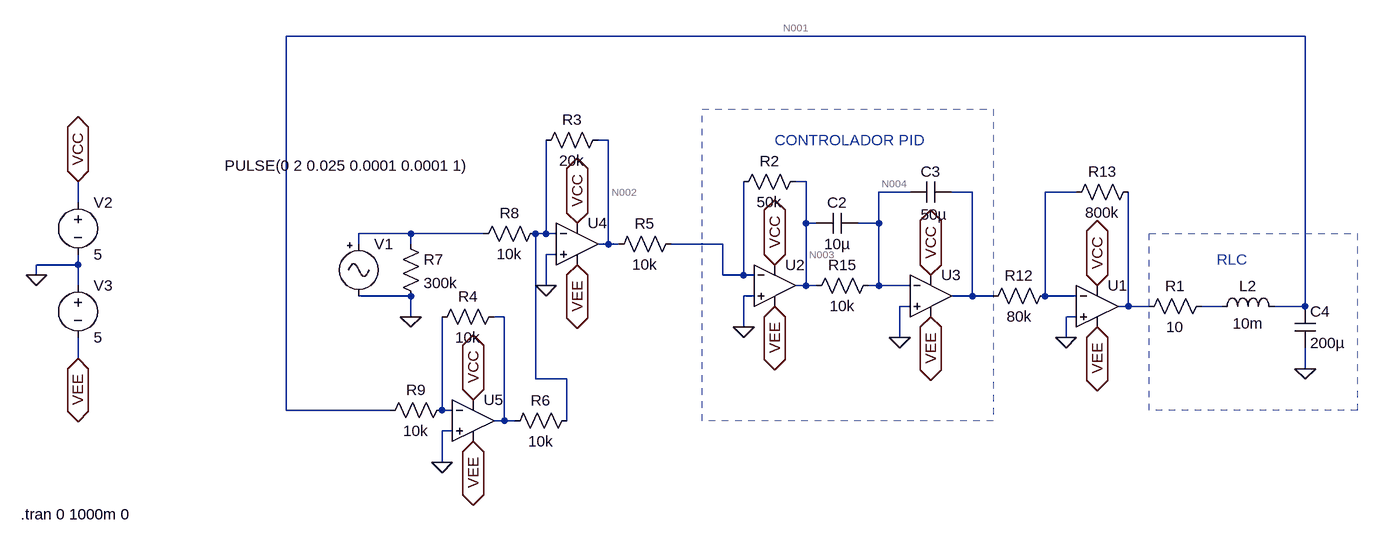
[diagram p0: schematic Pid.asc]
Pid.asc, the LTspice schematic file:
Version 4.1
SHEET 1 3800 680
WIRE 3584 -1296 2016 -1296
WIRE 2512 -1136 2496 -1136
WIRE 2816 -1072 2800 -1072
WIRE 2976 -1056 2928 -1056
WIRE 3072 -1056 3040 -1056
WIRE 3232 -1056 3184 -1056
WIRE 1696 -1040 1696 -1072
WIRE 2816 -1008 2816 -1072
WIRE 2832 -1008 2816 -1008
WIRE 2928 -1008 2928 -1056
WIRE 2928 -1008 2896 -1008
WIRE 2208 -992 2128 -992
WIRE 2320 -992 2208 -992
WIRE 2416 -992 2416 -1136
WIRE 2416 -992 2400 -992
WIRE 2432 -992 2416 -992
WIRE 2128 -976 2128 -992
WIRE 2208 -976 2208 -992
WIRE 2512 -976 2512 -1136
WIRE 2512 -976 2496 -976
WIRE 2528 -976 2512 -976
WIRE 2688 -976 2608 -976
WIRE 2432 -960 2416 -960
WIRE 1696 -944 1696 -960
WIRE 1696 -944 1632 -944
WIRE 1632 -928 1632 -944
WIRE 2688 -928 2688 -976
WIRE 2720 -928 2720 -1072
WIRE 2720 -928 2688 -928
WIRE 2736 -928 2720 -928
WIRE 1696 -912 1696 -944
WIRE 2416 -912 2416 -960
WIRE 2816 -912 2816 -1008
WIRE 2816 -912 2800 -912
WIRE 2832 -912 2816 -912
WIRE 2928 -912 2928 -1008
WIRE 2928 -912 2912 -912
WIRE 2976 -912 2928 -912
WIRE 2208 -896 2128 -896
WIRE 2736 -896 2720 -896
WIRE 3072 -896 3072 -1056
WIRE 3072 -896 3040 -896
WIRE 3104 -896 3072 -896
WIRE 3184 -896 3184 -1056
WIRE 3232 -896 3184 -896
WIRE 2976 -880 2960 -880
WIRE 3312 -880 3312 -1056
WIRE 3312 -880 3296 -880
WIRE 3344 -880 3312 -880
WIRE 3456 -880 3424 -880
WIRE 3584 -880 3584 -1296
WIRE 3584 -880 3536 -880
WIRE 2208 -864 2208 -896
WIRE 2352 -864 2336 -864
WIRE 3232 -864 3216 -864
WIRE 2720 -848 2720 -896
WIRE 2960 -832 2960 -880
WIRE 3216 -832 3216 -864
WIRE 1696 -800 1696 -832
WIRE 3584 -784 3584 -816
WIRE 2400 -768 2400 -992
WIRE 2448 -768 2400 -768
WIRE 2016 -720 2016 -1296
WIRE 2176 -720 2016 -720
WIRE 2256 -720 2256 -864
WIRE 2272 -720 2256 -720
WIRE 2352 -704 2352 -864
WIRE 2352 -704 2336 -704
WIRE 2368 -704 2352 -704
WIRE 2448 -704 2448 -768
WIRE 2272 -688 2256 -688
WIRE 2256 -640 2256 -688
FLAG 1696 -1072 VCC
IOPIN 1696 -1072 BiDir
FLAG 1696 -800 VEE
IOPIN 1696 -800 BiDir
FLAG 3584 -784 0
FLAG 2960 -832 0
FLAG 2768 -944 VCC
IOPIN 2768 -944 BiDir
FLAG 3008 -928 VCC
IOPIN 3008 -928 BiDir
FLAG 2768 -880 VEE
IOPIN 2768 -880 BiDir
FLAG 3008 -864 VEE
IOPIN 3008 -864 BiDir
FLAG 3216 -832 0
FLAG 3264 -912 VCC
IOPIN 3264 -912 BiDir
FLAG 3264 -848 VEE
IOPIN 3264 -848 BiDir
FLAG 1632 -928 0
FLAG 2720 -848 0
FLAG 2464 -1008 VCC
IOPIN 2464 -1008 BiDir
FLAG 2464 -944 VEE
IOPIN 2464 -944 BiDir
FLAG 2416 -912 0
FLAG 2304 -736 VCC
IOPIN 2304 -736 BiDir
FLAG 2304 -672 VEE
IOPIN 2304 -672 BiDir
FLAG 2256 -640 0
FLAG 2208 -864 0
SYMBOL voltage 1696 -1056 R0
WINDOW 123 0 0 Left 0
WINDOW 39 0 0 Left 0
SYMATTR InstName V2
SYMATTR Value 5
SYMBOL voltage 1696 -928 R0
WINDOW 123 0 0 Left 0
WINDOW 39 0 0 Left 0
SYMATTR InstName V3
SYMATTR Value 5
SYMBOL res 2816 -896 R270
WINDOW 0 32 56 VTop 2
WINDOW 3 0 56 VBottom 2
SYMATTR InstName R15
SYMATTR Value 10k
SYMBOL cap 2896 -1024 R90
WINDOW 0 0 32 VBottom 2
WINDOW 3 32 32 VTop 2
SYMATTR InstName C2
SYMATTR Value 10µ
SYMBOL cap 3040 -1072 R90
WINDOW 0 0 32 VBottom 2
WINDOW 3 35 27 VTop 2
SYMATTR InstName C3
SYMATTR Value 50µ
SYMBOL ind 3440 -864 R270
WINDOW 0 32 56 VTop 2
WINDOW 3 5 56 VBottom 2
SYMATTR InstName L2
SYMATTR Value 10m
SYMBOL cap 3568 -880 R0
SYMATTR InstName C4
SYMATTR Value 200µ
SYMBOL res 3200 -912 R90
WINDOW 0 0 56 VBottom 2
WINDOW 3 32 56 VTop 2
SYMATTR InstName R12
SYMATTR Value 80k
SYMBOL res 3328 -1072 R90
WINDOW 0 0 56 VBottom 2
WINDOW 3 32 56 VTop 2
SYMATTR InstName R13
SYMATTR Value 800k
SYMBOL OpAmps\\UniversalOpAmp2 3264 -880 R0
SYMATTR InstName U1
SYMBOL res 3440 -896 R90
WINDOW 0 0 56 VBottom 2
WINDOW 3 32 56 VTop 2
SYMATTR InstName R1
SYMATTR Value 10
SYMBOL OpAmps\\UniversalOpAmp2 3008 -896 R0
SYMATTR InstName U3
SYMBOL OpAmps\\UniversalOpAmp2 2768 -912 R0
SYMATTR InstName U2
SYMBOL res 2816 -1088 R90
WINDOW 0 0 56 VBottom 2
WINDOW 3 32 56 VTop 2
SYMATTR InstName R2
SYMATTR Value 50k
SYMBOL OpAmps\\UniversalOpAmp2 2464 -976 R0
SYMATTR InstName U4
SYMBOL res 2512 -1152 R90
WINDOW 0 0 56 VBottom 2
WINDOW 3 32 56 VTop 2
SYMATTR InstName R3
SYMATTR Value 20k
SYMBOL OpAmps\\UniversalOpAmp2 2304 -704 R0
SYMATTR InstName U5
SYMBOL res 2352 -880 R90
WINDOW 0 0 56 VBottom 2
WINDOW 3 32 56 VTop 2
SYMATTR InstName R4
SYMATTR Value 10k
SYMBOL res 2624 -992 R90
WINDOW 0 0 56 VBottom 2
WINDOW 3 32 56 VTop 2
SYMATTR InstName R5
SYMATTR Value 10k
SYMBOL res 2464 -720 R90
WINDOW 0 0 56 VBottom 2
WINDOW 3 32 56 VTop 2
SYMATTR InstName R6
SYMATTR Value 10k
SYMBOL res 2192 -992 R0
SYMATTR InstName R7
SYMATTR Value 300k
SYMBOL res 2416 -1008 R90
WINDOW 0 0 56 VBottom 2
WINDOW 3 32 56 VTop 2
SYMATTR InstName R8
SYMATTR Value 10k
SYMBOL Misc\\signal 2128 -992 R0
WINDOW 3 -206 -105 Left 2
WINDOW 123 0 0 Left 0
WINDOW 39 0 0 Left 0
SYMATTR Value PULSE(0 2 0.025 0.0001 0.0001 1)
SYMATTR InstName V1
SYMBOL res 2272 -736 R90
WINDOW 0 0 56 VBottom 2
WINDOW 3 32 56 VTop 2
SYMATTR InstName R9
SYMATTR Value 10k
TEXT 2768 -1136 Left 2 ;CONTROLADOR PID
TEXT 3448 -952 Left 2 ;RLC
TEXT 1608 -560 Left 2 !.tran 0 1000m 0
RECTANGLE Normal 3104 -704 2656 -1184 2
RECTANGLE Normal 3664 -720 3344 -992 2

The netlist it stands for:
* Pid.asc
V2 VCC 0 5
V3 0 VEE 5
R15 N003 N004 10k
C2 N004 N003 10µ
C3 N005 N004 50µ
L2 N011 N001 10m
C4 N001 0 200µ
R12 N006 N005 80k
R13 N010 N006 800k
X§U1 0 N006 VCC VEE N010 level2 Avol=1Meg GBW=10Meg Slew=10Meg Ilimit=25m Rail=0 Vos=0 En=0 Enk=0 In=0 Ink=0 Rin=500Meg  ; pins In+ In- V+ V- OUT
R1 N011 N010 10
X§U3 0 N004 VCC VEE N005 level2 Avol=1Meg GBW=10Meg Slew=10Meg Ilimit=25m Rail=0 Vos=0 En=0 Enk=0 In=0 Ink=0 Rin=500Meg  ; pins In+ In- V+ V- OUT
X§U2 0 N009 VCC VEE N003 level2 Avol=1Meg GBW=10Meg Slew=10Meg Ilimit=25m Rail=0 Vos=0 En=0 Enk=0 In=0 Ink=0 Rin=500Meg  ; pins In+ In- V+ V- OUT
R2 N003 N009 50k
X§U4 0 N008 VCC VEE N002 level2 Avol=1Meg GBW=10Meg Slew=10Meg Ilimit=25m Rail=0 Vos=0 En=0 Enk=0 In=0 Ink=0 Rin=500Meg  ; pins In+ In- V+ V- OUT
R3 N002 N008 20k
X§U5 0 N013 VCC VEE N012 level2 Avol=1Meg GBW=10Meg Slew=10Meg Ilimit=25m Rail=0 Vos=0 En=0 Enk=0 In=0 Ink=0 Rin=500Meg  ; pins In+ In- V+ V- OUT
R4 N012 N013 10k
R5 N009 N002 10k
R6 N008 N012 10k
R7 N007 0 300k
R8 N008 N007 10k
V1 N007 0 PULSE(0 2 0.025 0.0001 0.0001 1)
R9 N013 N001 10k
* CONTROLADOR PID
* RLC
.tran 0 1000m 0
.lib UniversalOpAmp2.lib
.backanno
.end

* Results of the author's LTspice run, read from the files saved beside the schematic
* Operating Point, zero values left out:
*   V(vee) = -5 V
*   V(vcc) = 5 V
*   I(V2) = -2.5 mA
*   I(V3) = -2.5 mA
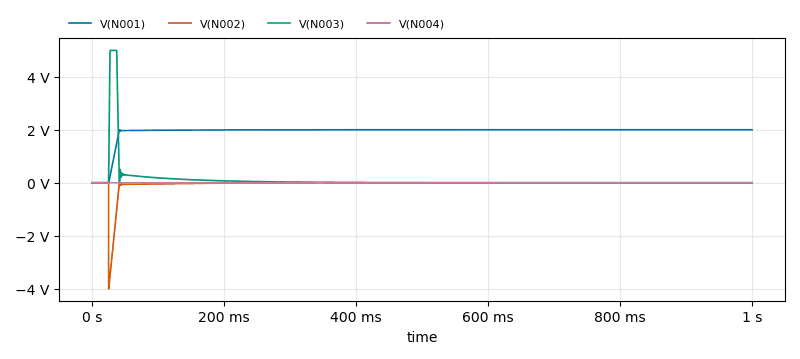
[diagram p1: Transient Analysis of Pid.asc, plotted from the saved traces]
* Transient Analysis, 1 run:
*   V(N001): min 0 V, max 2 V, average 1.93 V, rms 1.96 V, last 2 V
*   V(N002): min -3.999 V, max 0 V, average -39.55 mV, rms 297.2 mV, last -6.995 µV
*   V(N003): min -1.847 mV, max 4.994 V, average 100.1 mV, rms 558.1 mV, last 33.96 µV
*   V(N004): min -3.609 mV, max 14.39 mV, average 210.2 nV, rms 12.33 µV, last 369.1 nV